# EAGLE schematic 428-300-001 S120041 D&R.rpt (EAGLE 6.5)

## Sheet 1 of 4
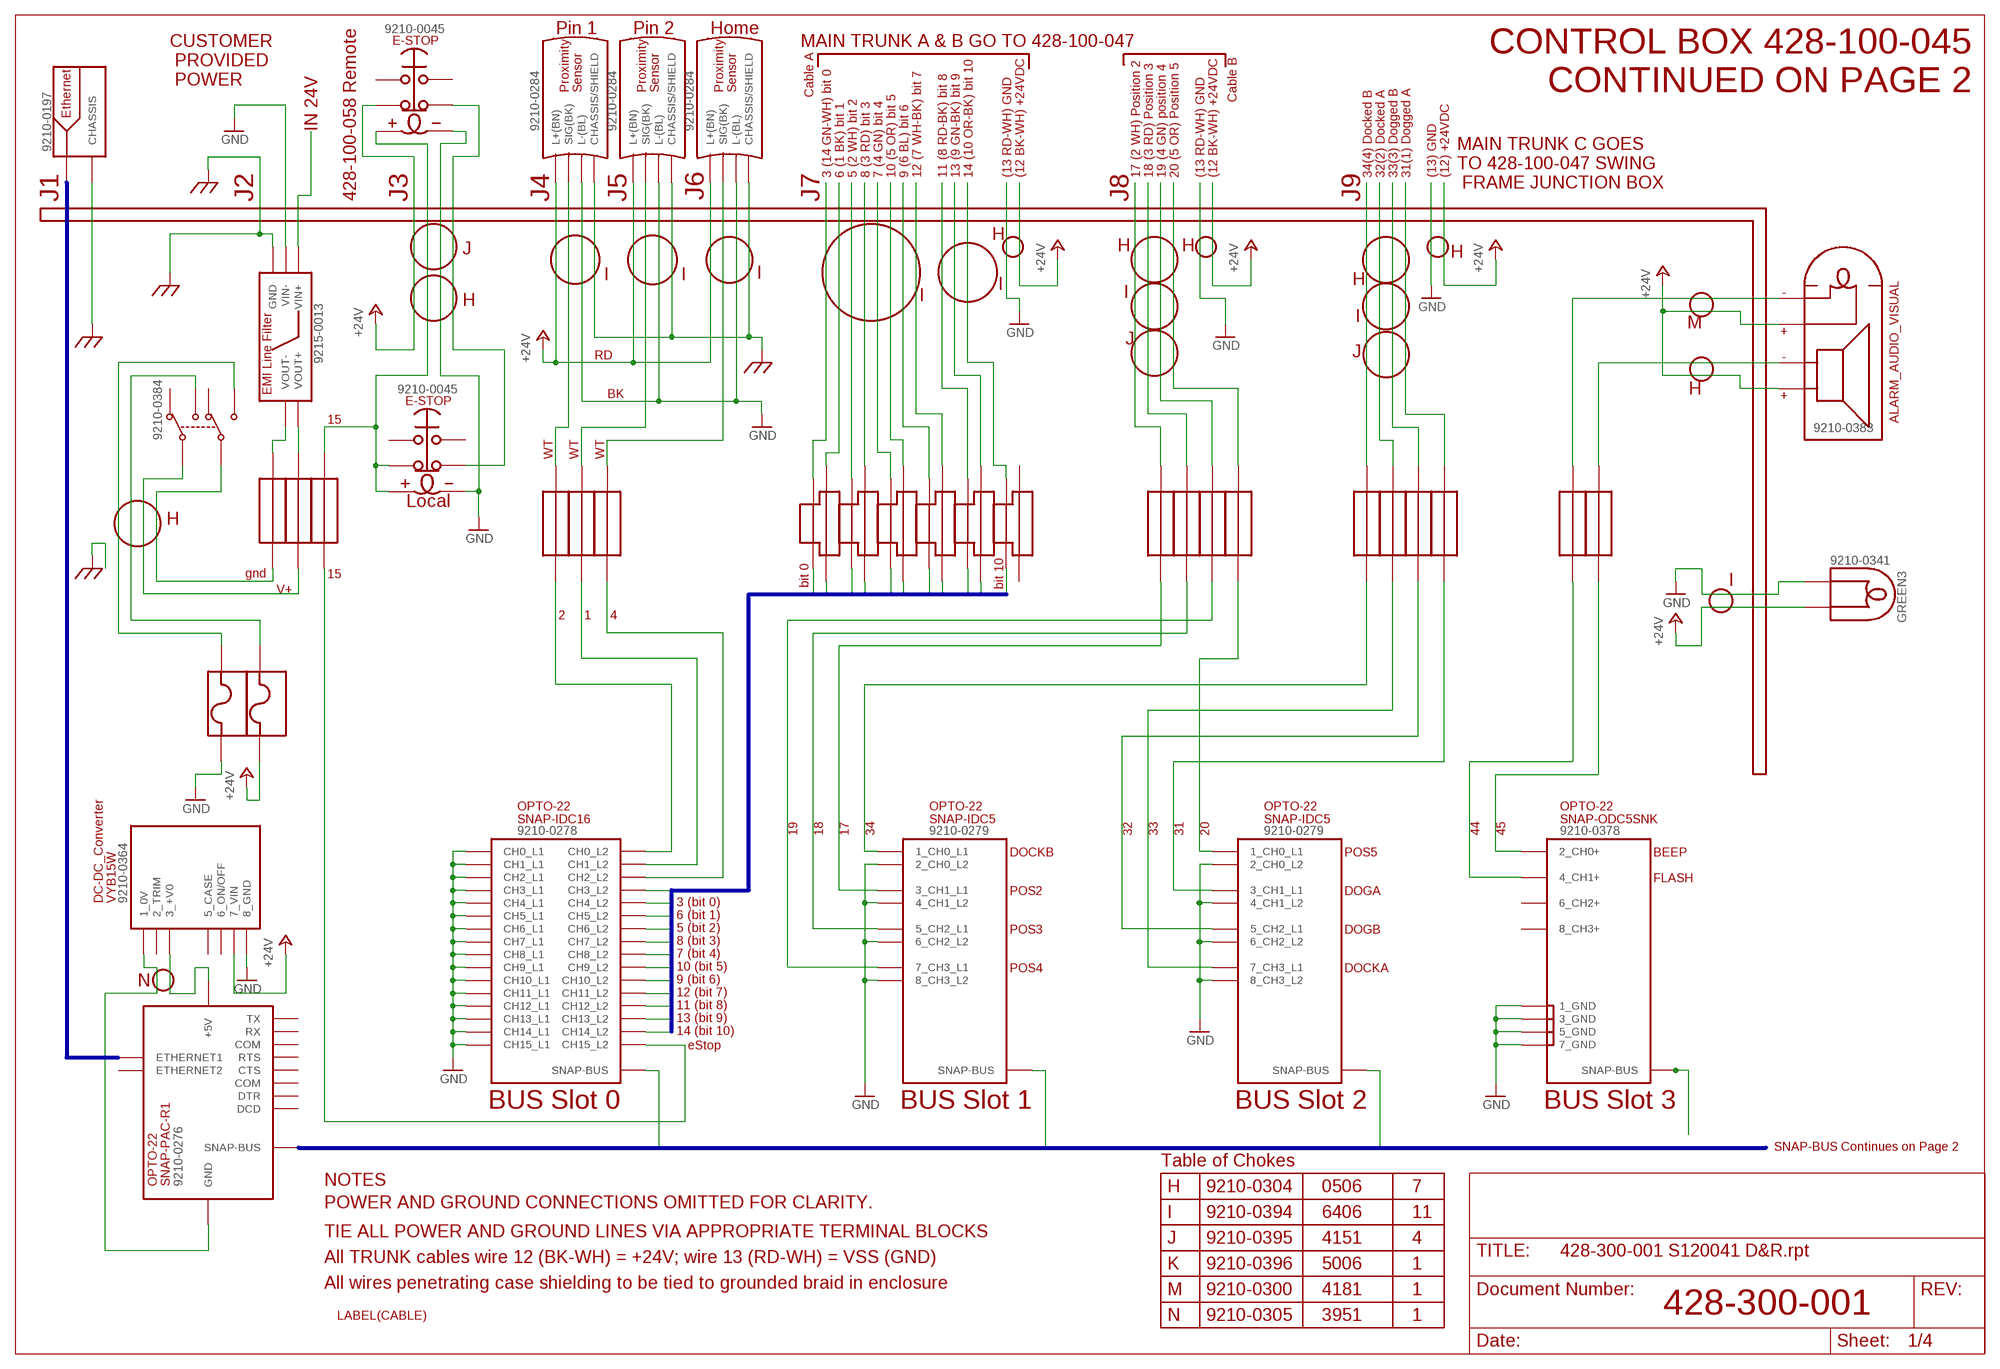
[diagram p0: schematic, sheet 1]

### Parts
GREEN3  9210-0341  INDICATOR_LIGHT  [BOGUS]
PE1  GND_CHASSIS  [BOGUS]
PE2  GND_CHASSIS  [BOGUS]
PE3  GND_CHASSIS  [BOGUS]
PE4  GND_CHASSIS  [BOGUS]
PE5  GND_CHASSIS  [BOGUS]
U$1  9210-0276  SNAP-PAC-R1  [BOGUS]
U$2  9210-0197  ETHERNET_PANEL_CONNECTOR9210-0197  [BOGUS]
U$3  9210-0278  SNAP-IDC16  [BOGUS]
U$4  9210-0279  SNAP-IDC5  [BOGUS]
U$5  9210-0279  SNAP-IDC5  [BOGUS]
U$6  9210-0364  DC-DC_CONVERTER_VYB15W  [BOGUS]
U$7  9210-0284  SENSOR_PROXIMITY  [BOGUS]
U$8  9210-0284  SENSOR_PROXIMITY  [BOGUS]
U$9  9210-0284  SENSOR_PROXIMITY  [BOGUS]
U$10  TERMINAL_BLOCK_3031160  [BOGUS]
U$11  TERMINAL_BLOCK_FUSED  [BOGUS]
U$12  TERMINAL_BLOCK_FUSED  [BOGUS]
U$13  9210-0045  SWITCH_ESTOP_LIGHTED  [BOGUS]
U$15  9210-0384  SWITCH_DPDT  [BOGUS]
U$16  9215-0013  FILTER_LINE_EMI  [BOGUS]
U$26  TERMINAL_BLOCK_3031160  [BOGUS]
U$27  TERMINAL_BLOCK_3031160  [BOGUS]
U$28  TERMINAL_BLOCK_3031160  [BOGUS]
U$29  TERMINAL_BLOCK_3031160  [BOGUS]
U$30  TERMINAL_BLOCK_3031160  [BOGUS]
U$31  9210-0045  SWITCH_ESTOP_LIGHTED  [BOGUS]
U$32  TERMINAL_BLOCK_1608510000  [BOGUS]
U$33  TERMINAL_BLOCK_1608510000  [BOGUS]
U$34  TERMINAL_BLOCK_1608510000  [BOGUS]
U$35  TERMINAL_BLOCK_1608510000  [BOGUS]
U$36  TERMINAL_BLOCK_1608510000  [BOGUS]
U$37  TERMINAL_BLOCK_1608510000  [BOGUS]
U$38  TERMINAL_BLOCK_1608510000  [BOGUS]
U$39  TERMINAL_BLOCK_1608510000  [BOGUS]
U$40  9210-0383  ALARM_AUDIO_VISUAL  [BOGUS]
U$41  TERMINAL_BLOCK_1608510000  [BOGUS]
U$42  TERMINAL_BLOCK_1608510000  [BOGUS]
U$43  TERMINAL_BLOCK_1608510000  [BOGUS]
U$44  TERMINAL_BLOCK_1608510000  [BOGUS]
U$45  TERMINAL_BLOCK_1608510000  [BOGUS]
U$46  TERMINAL_BLOCK_1608510000  [BOGUS]
U$47  TERMINAL_BLOCK_1608510000  [BOGUS]
U$48  TERMINAL_BLOCK_1608510000  [BOGUS]
U$49  9210-0378  SNAP-ODC5SNK  [BOGUS]

### Nets
+24V: GREEN3.P$2 U$6.P$7(7_VIN) U$7.P$2(L+(BN)) U$8.P$2(L+(BN)) U$9.P$2(L+(BN)) U$12.P$1 U$13.P$2 U$40.P$2 U$40.P$3 ; also sheet 2,3
B$1: U$3.P$33(SNAP-BUS) U$4.P$9(SNAP-BUS) U$5.P$9(SNAP-BUS) U$49.P$9(SNAP-BUS)
BIT1: U$3.P$30(CH14_L2)
BIT2: U$3.P$28(CH13_L2) U$30.P$1
BIT3: U$3.P$26(CH12_L2) U$29.P$2
BIT4: U$3.P$24(CH11_L2) U$29.P$1
BIT5: U$3.P$22(CH10_L2) U$28.P$2
BIT6: U$3.P$20(CH9_L2) U$28.P$1
BIT7: U$3.P$18(CH8_L2) U$27.P$2
BIT8: U$3.P$16(CH7_L2) U$27.P$1
BIT9: U$3.P$14(CH6_L2) U$26.P$2
BIT10: U$3.P$12(CH5_L2) U$26.P$1
BIT11: U$3.P$10(CH4_L2) U$10.P$2
BIT36: U$3.P$8(CH3_L2) U$10.P$1
GND: GREEN3.P$1 U$3.P$1(CH0_L1) U$3.P$3(CH1_L1) U$3.P$5(CH2_L1) U$3.P$7(CH3_L1) U$3.P$9(CH4_L1) U$3.P$11(CH5_L1) U$3.P$13(CH6_L1) U$3.P$15(CH7_L1) U$3.P$17(CH8_L1) U$3.P$19(CH9_L1) U$3.P$21(CH10_L1) U$3.P$23(CH11_L1) U$3.P$25(CH12_L1) U$3.P$27(CH13_L1) U$3.P$29(CH14_L1) U$3.P$31(CH15_L1) U$4.P$2(2_CH0_L2) U$4.P$4(4_CH1_L2) U$4.P$6(6_CH2_L2) U$4.P$8(8_CH3_L2) U$5.P$2(2_CH0_L2) U$5.P$4(4_CH1_L2) U$5.P$6(6_CH2_L2) U$5.P$8(8_CH3_L2) U$6.P$8(8_GND) U$7.P$3(L-(BL)) U$8.P$3(L-(BL)) U$9.P$3(L-(BL)) U$11.P$1 U$13.P$6 U$16.P$3(VIN-) U$31.P$6 U$49.P$5(1_GND) U$49.P$6(3_GND) U$49.P$7(5_GND) U$49.P$8(7_GND) ; also sheet 2,3
N$1: U$1.P$9(GND) U$6.P$2(1_0V)
N$2: U$1.P$1(+5V) U$6.P$4(3_+V0)
N$6: U$30.P$4
N$7: U$29.P$3
N$8: U$29.P$4
N$9: U$28.P$3
N$10: U$28.P$4
N$11: U$27.P$3
N$12: U$27.P$4
N$13: U$26.P$3
N$14: U$16.P$2(VIN+)
N$15: U$26.P$4
N$16: U$10.P$3
N$21: U$16.P$5(VOUT-) U$48.P$2
N$22: U$16.P$4(VOUT+) U$47.P$2
N$28: U$10.P$4
N$29: U$7.P$4(SIG(BK)) U$45.P$2
N$30: U$8.P$4(SIG(BK)) U$44.P$2
N$31: U$9.P$4(SIG(BK)) U$43.P$2
N$32: U$5.P$1(1_CH0_L1) U$39.P$1
N$33: U$5.P$3(3_CH1_L1) U$38.P$1
N$34: U$5.P$5(5_CH2_L1) U$37.P$1
N$35: U$5.P$7(7_CH3_L1) U$36.P$1
N$36: U$4.P$1(1_CH0_L1) U$35.P$1
N$37: U$4.P$3(3_CH1_L1) U$34.P$1
N$38: U$4.P$5(5_CH2_L1) U$33.P$1
N$39: U$4.P$7(7_CH3_L1) U$32.P$1
N$40: U$32.P$2
N$41: U$34.P$2
N$42: U$35.P$2
N$43: U$36.P$2
N$44: U$37.P$2
N$45: U$38.P$2
N$46: U$39.P$2
N$47: U$13.P$4 U$31.P$4
N$48: U$3.P$32(CH15_L2) U$46.P$1
N$49: U$33.P$2
N$50: U$41.P$1 U$49.P$2(4_CH1+)
N$51: U$42.P$1 U$49.P$1(2_CH0+)
N$52: U$40.P$1 U$42.P$2
N$53: U$40.P$4 U$41.P$2
N$54: U$3.P$6(CH2_L2) U$43.P$1
N$55: U$3.P$4(CH1_L2) U$44.P$1
N$56: U$3.P$2(CH0_L2) U$45.P$1
N$58: U$15.P$4 U$48.P$1
N$59: U$15.P$1 U$47.P$1
N$60: U$12.P$2 U$15.P$3
N$61: U$11.P$2 U$15.P$6
N$62: U$13.P$5 U$31.P$2 U$31.P$5 U$46.P$2
PE: PE1.P$1(PE) PE2.P$1(PE) PE3.P$1(PE) PE4.P$1(PE) PE5.P$1(PE) U$2.P$2(CHASSIS) U$7.P$1(CHASSIS/SHIELD) U$8.P$1(CHASSIS/SHIELD) U$9.P$1(CHASSIS/SHIELD) U$16.P$1(GND) ; also sheet 3
Unconnected: U$1.P$2(COM) U$1.P$3(COM) U$1.P$4(CTS) U$1.P$5(DCD) U$1.P$6(DTR) U$1.P$7(ETHERNET1) U$1.P$8(ETHERNET2) U$1.P$10(RTS) U$1.P$11(RX) U$1.P$12(SNAP-BUS) U$1.P$13(TX) U$2.P$1 U$6.P$3(2_TRIM) U$6.P$5(5_CASE) U$6.P$6(6_ON/OFF) U$13.P$1 U$13.P$3 U$15.P$2 U$15.P$5 U$30.P$2 U$30.P$3 U$31.P$1 U$31.P$3 U$49.P$3(6_CH2+) U$49.P$4(8_CH3+)

### Buses
B$1
BIT[0..11]
B$2

### Notes on the sheet
- 428-100-058 Remote | CONTROL BOX 428-100-045
- Pin 1 | Pin 2 | Home
- CUSTOMER | MAIN TRUNK A & B GO TO 428-100-047
- PROVIDED | CONTINUED ON PAGE 2
- POWER
- Cable A
- Cable B
- IN 24V
- MAIN TRUNK C GOES
- TO 428-100-047 SWING
- 3 (14 GN-WH) bit 0 | 6 (1 BK) bit 1 | 5 (2 WH) bit 2 | 8 (3 RD) bit 3 | 7 (4 GN) bit 4 | 10 (5 OR) bit 5 | 9 (6 BL) bit 6 | 12 (7 WH-BK) bit 7 | 11 (8 RD-BK) bit 8 | 13 (9 GN-BK) bit 9 | 14 (10 OR-BK) bit 10 | (13 RD-WH) GND | (12 BK-WH) +24VDC | 17 (2 WH) Position 2 | 18 (3 RD) Position 3 | 19 (4 GN) position 4 | 20 (5 OR) Position 5 | (13 RD-WH) GND | (12 BK-WH) +24VDC | 34(4) Docked B | 32(2) Docked A | 33(3) Dogged B | 31(1) Dogged A | (13) GND | (12) +24VDC
- FRAME JUNCTION BOX
- J1 | J2 | J3 | J4 | J5 | J6 | J7 | J8 | J9
- H
- J | H | H
- H
- I | I | I
- I | H
- I | -
- H | I
- I
- M
- +
- J
- RD | J | -
- BK | H
- +
- 15
- WT | WT | WT
- Local
- H
- gnd
- 15
- V+ | bit 0 | I
- bit 10
- 2 | 1 | 4
- 19 | 18 | 17 | 34 | 32 | 33 | 31 | 20 | 44 | 45
- DOCKB | POS5 | BEEP
- FLASH
- POS2 | DOGA
- 3 (bit 0)
- 6 (bit 1)
- 5 (bit 2) | POS3 | DOGB
- 8 (bit 3)
- 7 (bit 4)
- 10 (bit 5) | POS4 | DOCKA
- N | 9 (bit 6)
- 12 (bit 7)
- 11 (bit 8)
- 13 (bit 9)
- 14 (bit 10)
- eStop
- BUS Slot 0 | BUS Slot 1 | BUS Slot 2 | BUS Slot 3
- SNAP-BUS Continues on Page 2
- Table of Chokes
- NOTES
- H | 9210-0304 | 0506 | 7
- POWER AND GROUND CONNECTIONS OMITTED FOR CLARITY.
- I | 9210-0394 | 6406 | 11
- TIE ALL POWER AND GROUND LINES VIA APPROPRIATE TERMINAL BLOCKS
- J | 9210-0395 | 4151 | 4
- All TRUNK cables wire 12 (BK-WH) = +24V; wire 13 (RD-WH) = VSS (GND)
- K | 9210-0396 | 5006 | 1
- All wires penetrating case shielding to be tied to grounded braid in enclosure
- M | 9210-0300 | 4181 | 1
- 428-300-001
- LABEL(CABLE) | N | 9210-0305 | 3951 | 1

## Sheet 2 of 4
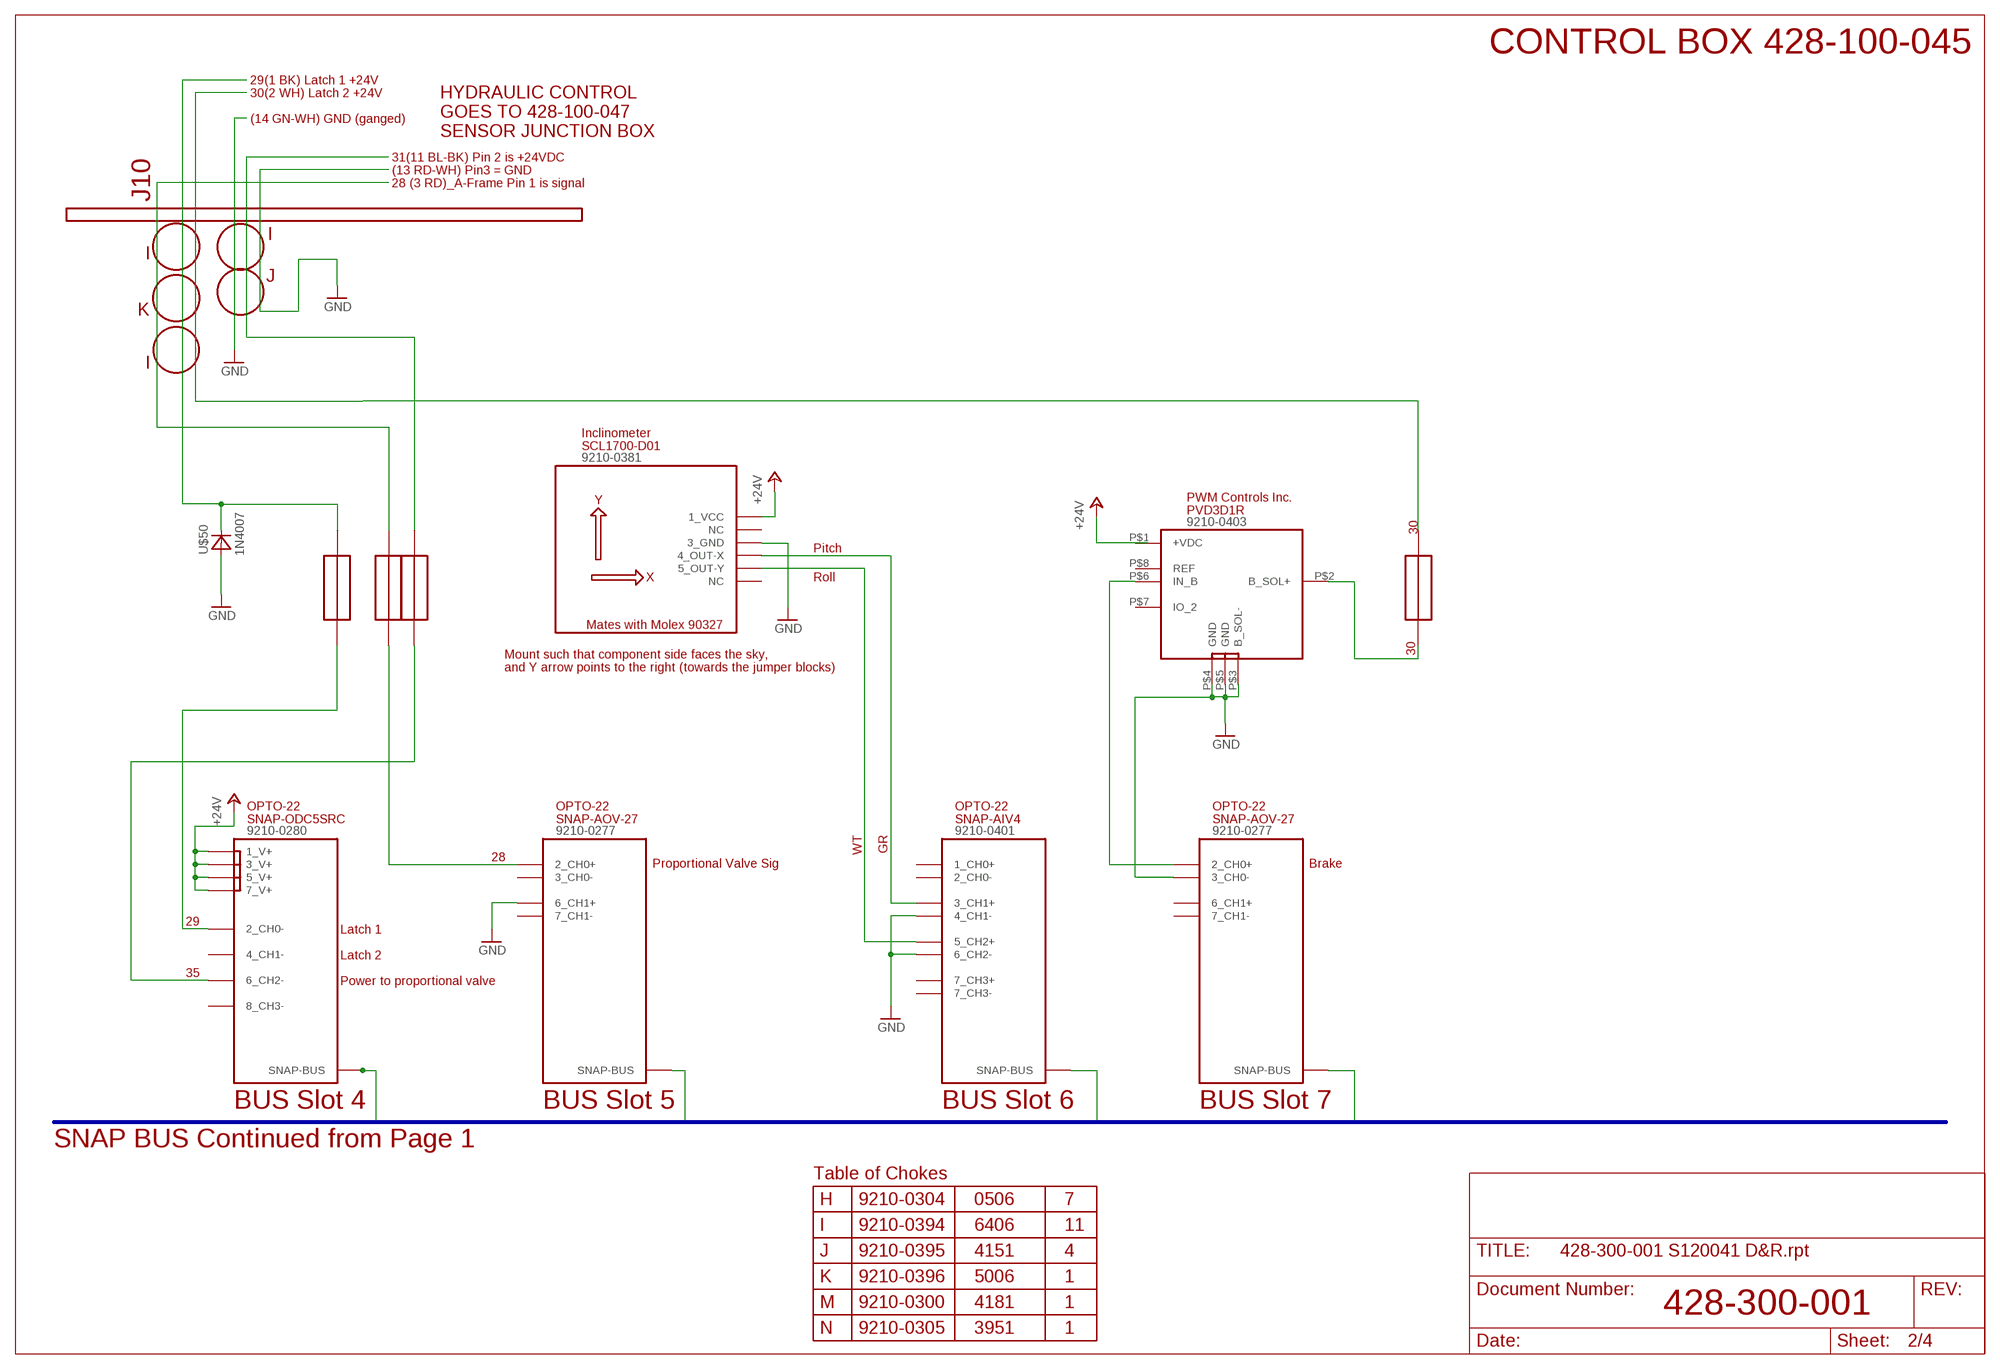
[diagram p1: schematic, sheet 2]

### Parts
U$14  9210-0277  SNAP-AOV-27  [BOGUS]
U$17  9210-0403  DRIVER_PWM_PVD3D1R  [BOGUS]
U$18  TERMINAL_BLOCK_1608510000  [BOGUS]
U$50  1N4007  [DO41]
U$51  9210-0381  INCLINOMETER_SCL1700-D01  [BOGUS]
U$78  TERMINAL_BLOCK_1608510000  [BOGUS]
U$80  TERMINAL_BLOCK_1608510000  [BOGUS]
U$122  TERMINAL_BLOCK_1608510000  [BOGUS]
U$126  9210-0280  SNAP-ODC5SRC  [BOGUS]
U$127  9210-0401  SNAP-AIV-4  [BOGUS]
U$131  9210-0277  SNAP-AOV-27  [BOGUS]

### Nets
+24V: U$51.P$1(1_VCC) U$126.P$1(1_V+) U$126.P$3(3_V+) U$126.P$5(5_V+) U$126.P$7(7_V+) ; also sheet 1,3
B$2: U$14.P$5(SNAP-BUS) U$126.P$9(SNAP-BUS) U$127.P$9(SNAP-BUS) U$131.P$5(SNAP-BUS)
GND: U$14.P$2(3_CH0-) U$17.P$3(B_SOL-) U$17.P$4(GND) U$17.P$5(GND) U$50.A U$51.P$2(3_GND) U$127.P$4(4_CH1-) U$127.P$6(6_CH2-) U$131.P$3(6_CH1+) ; also sheet 1,3
N$4: U$17.P$2(B_SOL+) U$18.P$1
N$5: U$14.P$1(2_CH0+) U$17.P$6(IN_B)
N$19: U$51.P$3(4_OUT-X) U$127.P$3(3_CH1+)
N$20: U$51.P$4(5_OUT-Y) U$127.P$5(5_CH2+)
N$23: U$18.P$2
N$93: U$80.P$1 U$131.P$1(2_CH0+)
N$94: U$50.C U$78.P$2
N$103: U$80.P$2
N$112: U$78.P$1 U$126.P$2(2_CH0-)
N$162: U$122.P$1 U$126.P$6(6_CH2-)
N$168: U$122.P$2
Unconnected: U$14.P$3(6_CH1+) U$14.P$4(7_CH1-) U$17.P$1(+VDC) U$17.P$7(IO_2) U$17.P$8(REF) U$51.P$5(NC) U$51.P$6(NC) U$126.P$4(4_CH1-) U$126.P$8(8_CH3-) U$127.P$1(1_CH0+) U$127.P$2(2_CH0-) U$127.P$7(7_CH3+) U$127.P$8(7_CH3-) U$131.P$2(3_CH0-) U$131.P$4(7_CH1-)

### Buses
B$1

### Notes on the sheet
- CONTROL BOX 428-100-045
- 29(1 BK) Latch 1 +24V
- 30(2 WH) Latch 2 +24V | HYDRAULIC CONTROL
- GOES TO 428-100-047
- (14 GN-WH) GND (ganged)
- SENSOR JUNCTION BOX
- 31(11 BL-BK) Pin 2 is +24VDC
- (13 RD-WH) Pin3 = GND
- 28 (3 RD)_A-Frame Pin 1 is signal
- J10
- I
- I
- J
- K
- I
- 30
- Pitch
- Roll
- Mount such that component side faces the sky, | 30
- and Y arrow points to the right (towards the jumper blocks)
- WT | GR
- 28
- Proportional Valve Sig | Brake
- 29
- Latch 1
- Latch 2
- 35
- Power to proportional valve
- BUS Slot 4 | BUS Slot 5 | BUS Slot 6 | BUS Slot 7
- SNAP BUS Continued from Page 1
- Table of Chokes
- H | 9210-0304 | 0506 | 7
- I | 9210-0394 | 6406 | 11
- J | 9210-0395 | 4151 | 4
- K | 9210-0396 | 5006 | 1
- M | 9210-0300 | 4181 | 1
- 428-300-001
- N | 9210-0305 | 3951 | 1

## Sheet 3 of 4
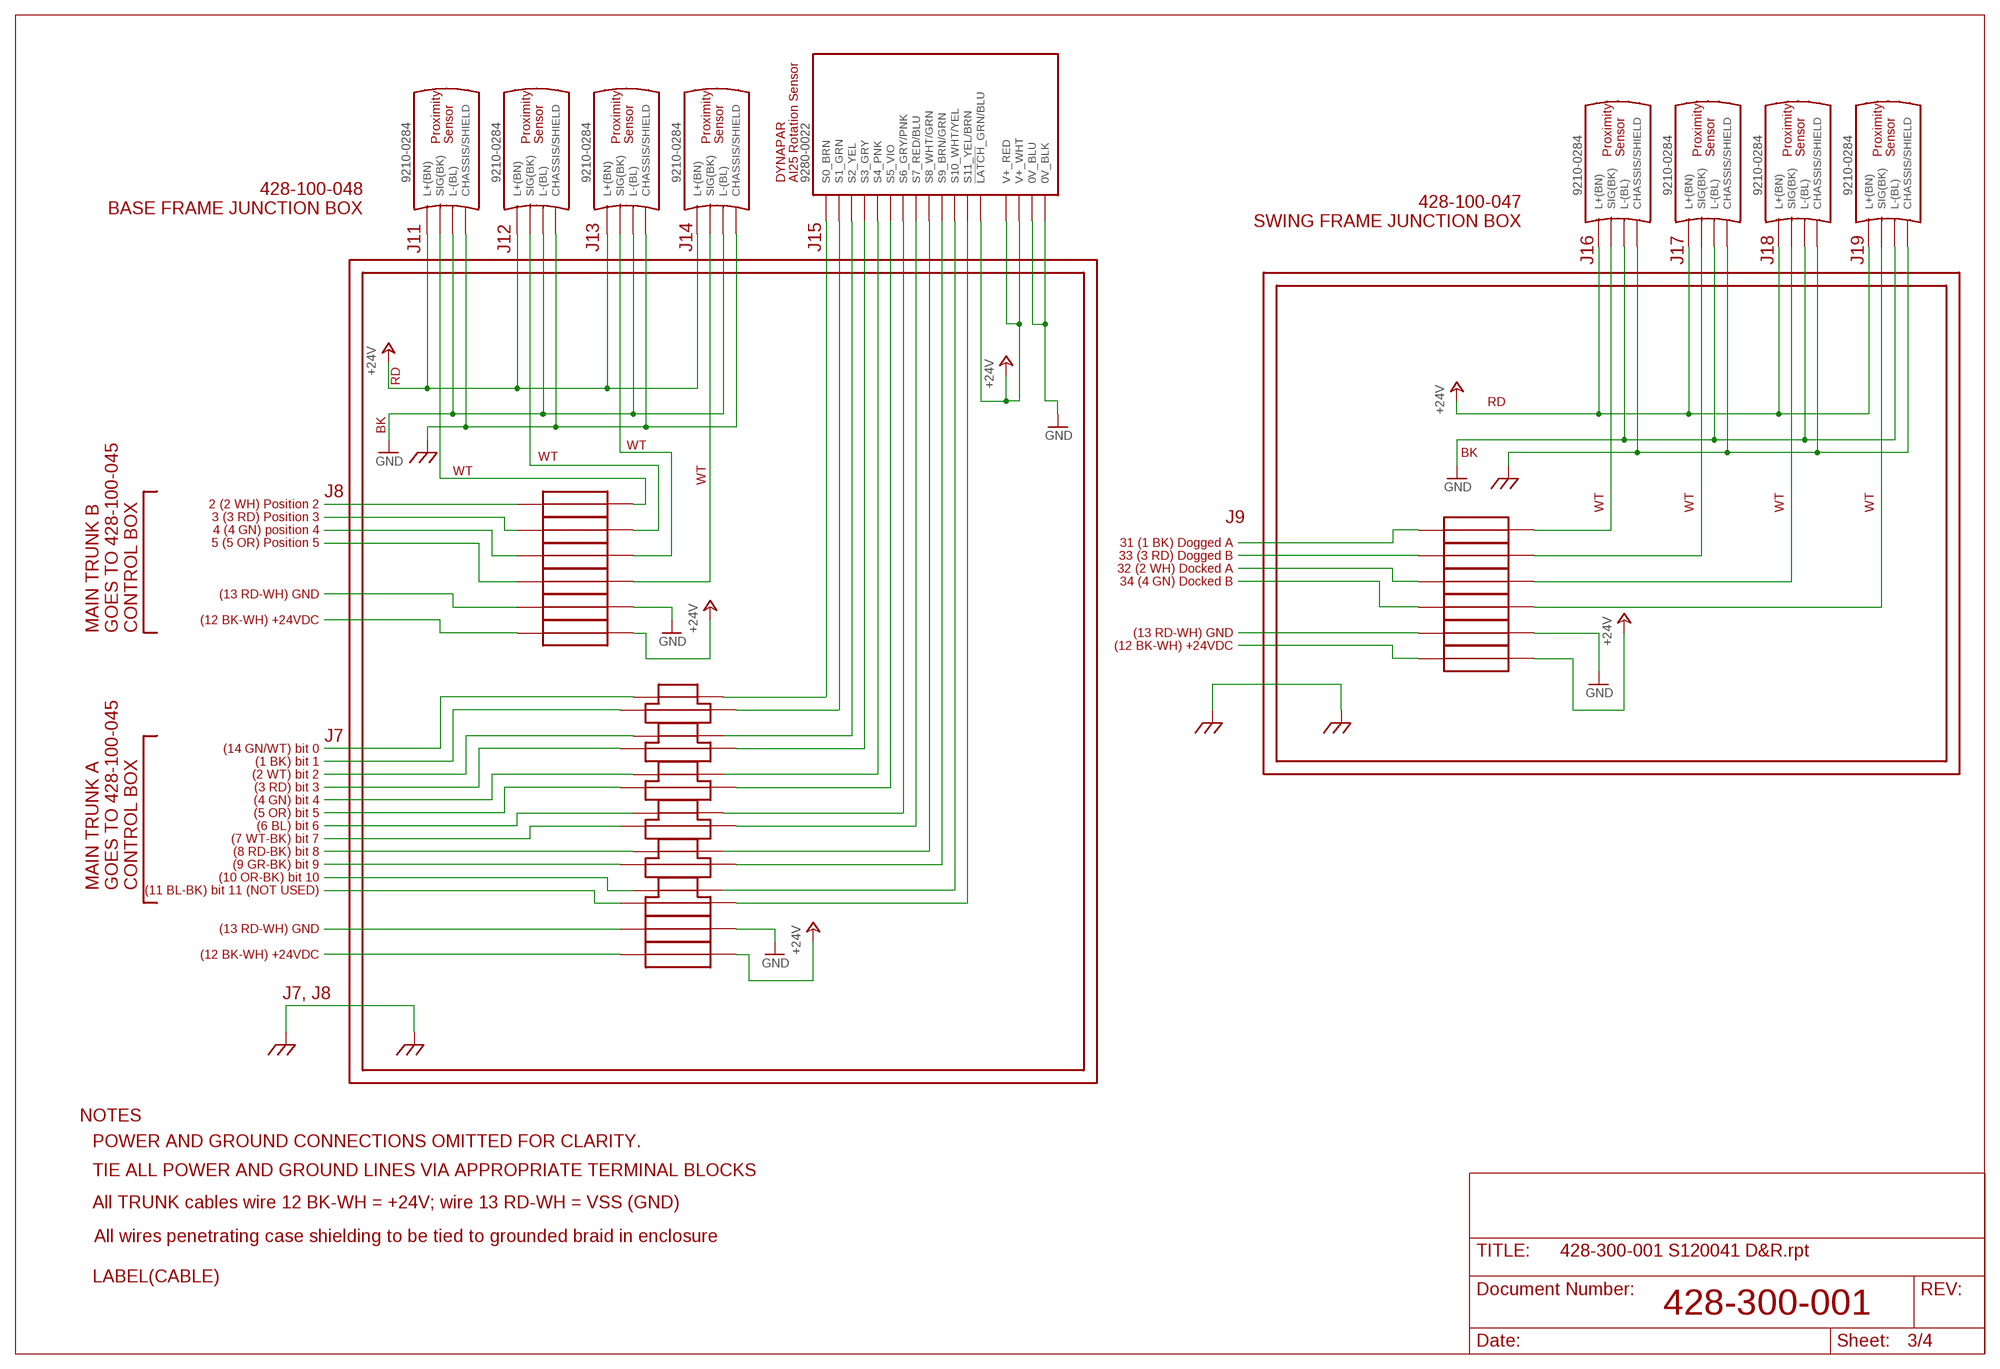
[diagram p2: schematic, sheet 3]

### Parts
PE9  GND_CHASSIS  [BOGUS]
PE10  GND_CHASSIS  [BOGUS]
PE11  GND_CHASSIS  [BOGUS]
PE12  GND_CHASSIS  [BOGUS]
PE19  GND_CHASSIS  [BOGUS]
PE20  GND_CHASSIS  [BOGUS]
U$63  TERMINAL_BLOCK_1608510000  [BOGUS]
U$64  TERMINAL_BLOCK_1608510000  [BOGUS]
U$81  TERMINAL_BLOCK_1608510000  [BOGUS]
U$87  TERMINAL_BLOCK_1608510000  [BOGUS]
U$88  TERMINAL_BLOCK_1608510000  [BOGUS]
U$89  TERMINAL_BLOCK_3031160  [BOGUS]
U$90  TERMINAL_BLOCK_3031160  [BOGUS]
U$91  TERMINAL_BLOCK_3031160  [BOGUS]
U$92  TERMINAL_BLOCK_3031160  [BOGUS]
U$93  TERMINAL_BLOCK_3031160  [BOGUS]
U$94  TERMINAL_BLOCK_3031160  [BOGUS]
U$95  TERMINAL_BLOCK_1608510000  [BOGUS]
U$96  9210-0284  SENSOR_PROXIMITY  [BOGUS]
U$97  9210-0284  SENSOR_PROXIMITY  [BOGUS]
U$98  9210-0284  SENSOR_PROXIMITY  [BOGUS]
U$99  9210-0284  SENSOR_PROXIMITY  [BOGUS]
U$100  TERMINAL_BLOCK_1608510000  [BOGUS]
U$101  TERMINAL_BLOCK_1608510000  [BOGUS]
U$102  TERMINAL_BLOCK_1608510000  [BOGUS]
U$103  TERMINAL_BLOCK_1608510000  [BOGUS]
U$104  TERMINAL_BLOCK_1608510000  [BOGUS]
U$105  TERMINAL_BLOCK_1608510000  [BOGUS]
U$106  9210-0284  SENSOR_PROXIMITY  [BOGUS]
U$107  9210-0284  SENSOR_PROXIMITY  [BOGUS]
U$108  9210-0284  SENSOR_PROXIMITY  [BOGUS]
U$109  9210-0284  SENSOR_PROXIMITY  [BOGUS]
U$110  9280-0022  ENCODER_AI25  [BOGUS]
U$111  TERMINAL_BLOCK_1608510000  [BOGUS]
U$112  TERMINAL_BLOCK_1608510000  [BOGUS]

### Nets
+24V: U$88.P$1 U$88.P$2 U$96.P$2(L+(BN)) U$97.P$2(L+(BN)) U$98.P$2(L+(BN)) U$99.P$2(L+(BN)) U$104.P$1 U$106.P$2(L+(BN)) U$107.P$2(L+(BN)) U$108.P$2(L+(BN)) U$109.P$2(L+(BN)) U$110.P$15(V+_RED) U$110.P$16(V+_WHT) U$110.P$17(!LATCH!_GRN/BLU) U$112.P$1 U$112.P$2 ; also sheet 1,2
GND: U$87.P$1 U$87.P$2 U$96.P$3(L-(BL)) U$97.P$3(L-(BL)) U$98.P$3(L-(BL)) U$99.P$3(L-(BL)) U$103.P$1 U$106.P$3(L-(BL)) U$107.P$3(L-(BL)) U$108.P$3(L-(BL)) U$109.P$3(L-(BL)) U$110.P$1(0V_BLK) U$110.P$2(0V_BLU) U$111.P$1 U$111.P$2 ; also sheet 1,2
N$104: U$90.P$1
N$105: U$90.P$2
N$106: U$89.P$1
N$107: U$89.P$2
N$108: U$91.P$1
N$109: U$91.P$2
N$110: U$92.P$1
N$111: U$92.P$2
N$116: U$93.P$1
N$121: U$93.P$2
N$122: U$94.P$1
N$123: U$94.P$2
N$124: U$81.P$2
N$125: U$63.P$2
N$126: U$95.P$2
N$127: U$64.P$2
N$128: U$94.P$3 U$110.P$14(S11_YEL/BRN)
N$129: U$94.P$4 U$110.P$13(S10_WHT/YEL)
N$130: U$93.P$3 U$110.P$12(S9_BRN/GRN)
N$131: U$93.P$4 U$110.P$11(S8_WHT/GRN)
N$132: U$92.P$3 U$110.P$10(S7_RED/BLU)
N$133: U$92.P$4 U$110.P$9(S6_GRY/PNK)
N$134: U$91.P$3 U$110.P$8(S5_VIO)
N$135: U$89.P$3 U$110.P$6(S3_GRY)
N$136: U$89.P$4 U$110.P$5(S2_YEL)
N$137: U$90.P$3 U$110.P$4(S1_GRN)
N$138: U$90.P$4 U$110.P$3(S0_BRN)
N$139: U$95.P$1 U$96.P$4(SIG(BK))
N$140: U$63.P$1 U$97.P$4(SIG(BK))
N$141: U$64.P$1 U$98.P$4(SIG(BK))
N$142: U$81.P$1 U$99.P$4(SIG(BK))
N$143: U$105.P$1 U$106.P$4(SIG(BK))
N$144: U$100.P$1 U$107.P$4(SIG(BK))
N$145: U$101.P$1 U$108.P$4(SIG(BK))
N$146: U$102.P$1 U$109.P$4(SIG(BK))
N$147: U$105.P$2
N$148: U$101.P$2
N$149: U$102.P$2
N$150: U$103.P$2
N$151: U$100.P$2
N$152: U$104.P$2
N$153: U$91.P$4 U$110.P$7(S4_PNK)
PE: PE9.P$1(PE) PE10.P$1(PE) PE11.P$1(PE) PE12.P$1(PE) PE19.P$1(PE) PE20.P$1(PE) U$96.P$1(CHASSIS/SHIELD) U$97.P$1(CHASSIS/SHIELD) U$98.P$1(CHASSIS/SHIELD) U$99.P$1(CHASSIS/SHIELD) U$106.P$1(CHASSIS/SHIELD) U$107.P$1(CHASSIS/SHIELD) U$108.P$1(CHASSIS/SHIELD) U$109.P$1(CHASSIS/SHIELD) ; also sheet 1

### Notes on the sheet
- 428-100-048
- 428-100-047
- BASE FRAME JUNCTION BOX
- SWING FRAME JUNCTION BOX
- J11 | J12 | J13 | J14 | J15
- J16 | J17 | J18 | J19
- RD
- RD
- BK
- WT | BK
- WT
- WT
- J8 | WT
- 2 (2 WH) Position 2
- 3 (3 RD) Position 3 | J9 | WT | WT | WT | WT
- 4 (4 GN) position 4
- 5 (5 OR) Position 5 | 31 (1 BK) Dogged A
- 33 (3 RD) Dogged B
- 32 (2 WH) Docked A
- 34 (4 GN) Docked B
- (13 RD-WH) GND
- (12 BK-WH) +24VDC
- (13 RD-WH) GND
- MAIN TRUNK B | GOES TO 428-100-045 | CONTROL BOX
- (12 BK-WH) +24VDC
- J7
- (14 GN/WT) bit 0
- (1 BK) bit 1
- (2 WT) bit 2
- (3 RD) bit 3
- (4 GN) bit 4
- (5 OR) bit 5
- (6 BL) bit 6
- (7 WT-BK) bit 7
- (8 RD-BK) bit 8
- (9 GR-BK) bit 9
- (10 OR-BK) bit 10
- (11 BL-BK) bit 11 (NOT USED)
- MAIN TRUNK A | GOES TO 428-100-045 | CONTROL BOX
- (13 RD-WH) GND
- (12 BK-WH) +24VDC
- J7, J8
- NOTES
- POWER AND GROUND CONNECTIONS OMITTED FOR CLARITY.
- TIE ALL POWER AND GROUND LINES VIA APPROPRIATE TERMINAL BLOCKS
- All TRUNK cables wire 12 BK-WH = +24V; wire 13 RD-WH = VSS (GND)
- All wires penetrating case shielding to be tied to grounded braid in enclosure
- LABEL(CABLE)
- 428-300-001

## Sheet 4 of 4
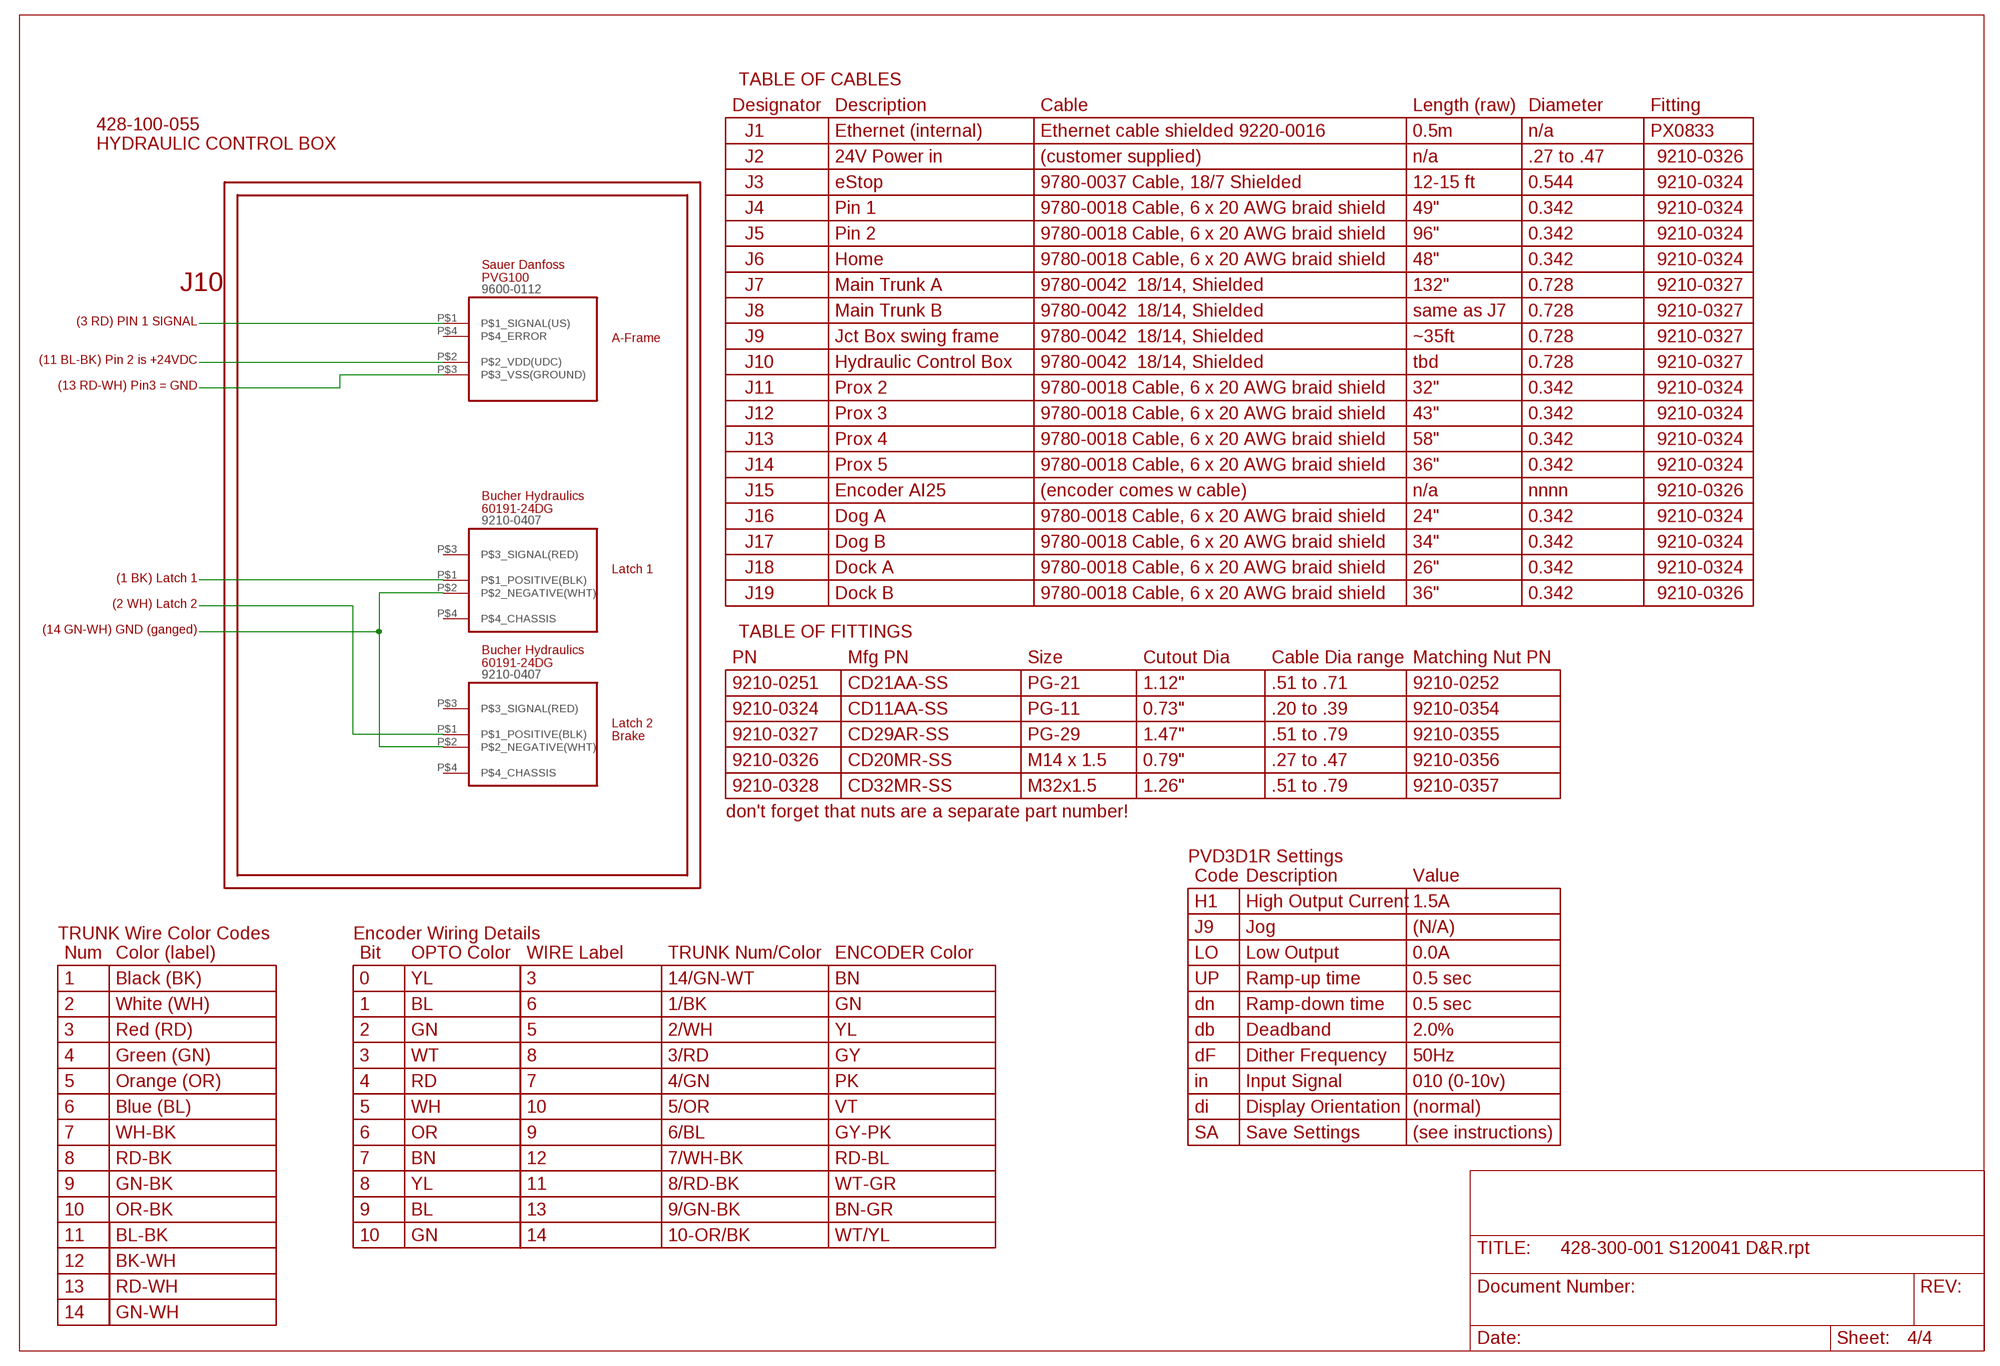
[diagram p3: schematic, sheet 4]

### Parts
U$82  9600-0112  VALVE_HYDRAULIC_PROPORTIONAL  [BOGUS]
U$85  9210-0407  VALVE_HYDRAULIC_SOLENOID  [BOGUS]
U$86  9210-0407  VALVE_HYDRAULIC_SOLENOID  [BOGUS]

### Nets
N$3: U$86.P$1(P$1_POSITIVE(BLK))
N$101: U$82.P$1(P$1_SIGNAL(US))
N$102: U$85.P$1(P$1_POSITIVE(BLK))
N$113: U$85.P$2(P$2_NEGATIVE(WHT)) U$86.P$2(P$2_NEGATIVE(WHT))
N$114: U$82.P$3(P$3_VSS(GROUND))
N$115: U$82.P$2(P$2_VDD(UDC))
Unconnected: U$82.P$4(P$4_ERROR) U$85.P$3(P$3_SIGNAL(RED)) U$85.P$4(P$4_CHASSIS) U$86.P$3(P$3_SIGNAL(RED)) U$86.P$4(P$4_CHASSIS)

### Notes on the sheet
- TABLE OF CABLES
- Designator | Description | Cable | Length (raw) | Diameter | Fitting
- 428-100-055
- J1 | Ethernet (internal) | Ethernet cable shielded 9220-0016 | 0.5m | n/a | PX0833
- HYDRAULIC CONTROL BOX
- J2 | 24V Power in | (customer supplied) | n/a | .27 to .47 | 9210-0326
- J3 | eStop | 9780-0037 Cable, 18/7 Shielded | 12-15 ft | 0.544 | 9210-0324
- J4 | Pin 1 | 9780-0018 Cable, 6 x 20 AWG braid shield | 49" | 0.342 | 9210-0324
- J5 | Pin 2 | 9780-0018 Cable, 6 x 20 AWG braid shield | 96" | 0.342 | 9210-0324
- J6 | Home | 9780-0018 Cable, 6 x 20 AWG braid shield | 48" | 0.342 | 9210-0324
- J10 | J7 | Main Trunk A | 9780-0042  18/14, Shielded | 132" | 0.728 | 9210-0327
- (3 RD) PIN 1 SIGNAL | J8 | Main Trunk B | 9780-0042  18/14, Shielded | same as J7 | 0.728 | 9210-0327
- A-Frame | J9 | Jct Box swing frame | 9780-0042  18/14, Shielded | ~35ft | 0.728 | 9210-0327
- (11 BL-BK) Pin 2 is +24VDC
- J10 | Hydraulic Control Box | 9780-0042  18/14, Shielded | tbd | 0.728 | 9210-0327
- (13 RD-WH) Pin3 = GND
- J11 | Prox 2 | 9780-0018 Cable, 6 x 20 AWG braid shield | 32" | 0.342 | 9210-0324
- J12 | Prox 3 | 9780-0018 Cable, 6 x 20 AWG braid shield | 43" | 0.342 | 9210-0324
- J13 | Prox 4 | 9780-0018 Cable, 6 x 20 AWG braid shield | 58" | 0.342 | 9210-0324
- J14 | Prox 5 | 9780-0018 Cable, 6 x 20 AWG braid shield | 36" | 0.342 | 9210-0324
- J15 | Encoder AI25 | (encoder comes w cable) | n/a | nnnn | 9210-0326
- J16 | Dog A | 9780-0018 Cable, 6 x 20 AWG braid shield | 24" | 0.342 | 9210-0324
- J17 | Dog B | 9780-0018 Cable, 6 x 20 AWG braid shield | 34" | 0.342 | 9210-0324
- (1 BK) Latch 1 | Latch 1 | J18 | Dock A | 9780-0018 Cable, 6 x 20 AWG braid shield | 26" | 0.342 | 9210-0324
- (2 WH) Latch 2 | J19 | Dock B | 9780-0018 Cable, 6 x 20 AWG braid shield | 36" | 0.342 | 9210-0326
- (14 GN-WH) GND (ganged)
- TABLE OF FITTINGS
- PN | Mfg PN | Size | Cutout Dia | Cable Dia range | Matching Nut PN
- 9210-0251 | CD21AA-SS | PG-21 | 1.12" | .51 to .71 | 9210-0252
- 9210-0324 | CD11AA-SS | PG-11 | 0.73" | .20 to .39 | 9210-0354
- Latch 2
- Brake | 9210-0327 | CD29AR-SS | PG-29 | 1.47" | .51 to .79 | 9210-0355
- 9210-0326 | CD20MR-SS | M14 x 1.5 | 0.79" | .27 to .47 | 9210-0356
- 9210-0328 | CD32MR-SS | M32x1.5 | 1.26" | .51 to .79 | 9210-0357
- don't forget that nuts are a separate part number!
- PVD3D1R Settings
- Code | Description | Value
- H1 | High Output Current | 1.5A
- J9 | Jog | (N/A)
- TRUNK Wire Color Codes | Encoder Wiring Details
- Num | Color (label) | Bit | OPTO Color | WIRE Label | TRUNK Num/Color | ENCODER Color | LO | Low Output | 0.0A
- 1 | Black (BK) | 0 | YL | 3 | 14/GN-WT | BN | UP | Ramp-up time | 0.5 sec
- 2 | White (WH) | 1 | BL | 6 | 1/BK | GN | dn | Ramp-down time | 0.5 sec
- 3 | Red (RD) | 2 | GN | 5 | 2/WH | YL | db | Deadband | 2.0%
- 4 | Green (GN) | 3 | WT | 8 | 3/RD | GY | dF | Dither Frequency | 50Hz
- 5 | Orange (OR) | 4 | RD | 7 | 4/GN | PK | in | Input Signal | 010 (0-10v)
- 6 | Blue (BL) | 5 | WH | 10 | 5/OR | VT | di | Display Orientation | (normal)
- 7 | WH-BK | 6 | OR | 9 | 6/BL | GY-PK | SA | Save Settings | (see instructions)
- 8 | RD-BK | 7 | BN | 12 | 7/WH-BK | RD-BL
- 9 | GN-BK | 8 | YL | 11 | 8/RD-BK | WT-GR
- 10 | OR-BK | 9 | BL | 13 | 9/GN-BK | BN-GR
- 11 | BL-BK | 10 | GN | 14 | 10-OR/BK | WT/YL
- 12 | BK-WH
- 13 | RD-WH
- 14 | GN-WH

## Library data of the parts
GREEN3 = DougM-SOSI-Wiring-Diagram:INDICATOR_LIGHT: 9210-0341 OMPBD7D-P3N3 Indicator Light, LED, Complete Asssembly, 22.5mm, IP66, 24V AC/DC Omega www.omega.com
PE1-PE5 PE9-PE12 PE19 PE20 = DougM-SOSI-Wiring-Diagram:GND_CHASSIS: SUPPLY SYMBOL
U$1 = DougM-SOSI-Wiring-Diagram:SNAP-PAC-R1: 9210-0276 SNAP-PAC-R1 Controller, Programmable Automation, R-Series, Analog, Full Digital, Serial Opto 22 Opto 22
U$2 = DougM-SOSI-Wiring-Diagram:ETHERNET_PANEL_CONNECTOR: 9210-0197 Connector, Panel Mount, Cat5e Coupler + Earth Wire, W/ Panel Sealing Gasket Digikey 708-1366-ND
U$3 = DougM-SOSI-Wiring-Diagram:SNAP-IDC16: 9210-0278 SNAP-IDC16 Module, Digital (Discrete) Input, Isolated 16-pt, 10-32 VDC Opto 22 Opto 22
U$4 U$5 = DougM-SOSI-Wiring-Diagram:SNAP-IDC5: 9210-0279 SNAP-IDC5 Module, Digital (Discrete) Input, 4-Channel 10-32 VAC/VDC Opto 22 Opto 22
U$6 = DougM-SOSI-Wiring-Diagram:DC-DC_CONVERTER_VYB15W: 9210-0364 VYB15W-Q24-S5-T Converter, DC/DC, 15W, 5V, 3A, CUI Inc. #VYB15W-Q24-S5-T CUI Inc Digikey 102-2334-ND
U$7-U$9 U$96-U$99 U$106-U$109 = DougM-SOSI-Wiring-Diagram:SENSOR_PROXIMITY: 9210-0023 Proximity Sensor, Inductive, 5mm Dia., 10-30 VDC, 3-wire, NPN, Shielded, 1.5mm nominal sensing distance, N.O., 2-meter cable 9210-0088 Proximity Sensor, Inductive, 12mm Dia., 10-30 VDC, 3-wire, unshielded, 8mm nominal sensing distance, N.O., 2-meter cable 9210-0191 Proximity Sensor, Inductive, 8mm Dia., extended range, 10-30 VDC, 3-wire, NPN, N.O., 4mm nominal sensing distance, unshielded 2-meter cable 9210-0284 Sensor, Proximity, Inductive, 18mm Dia., Extended Range, 10-30 VDC, 3 Wire, NPN, shielded, 2-Meter Cable Manufacturer Automation Direct
U$10 U$26-U$30 U$89-U$94 = DougM-SOSI-Wiring-Diagram:TERMINAL_BLOCK_3031160: 9210-0343 3031160 FEED THROUGH TERM BLOCK 14-26AWG Phoenix Contact Digikey 277-4014-ND
U$11 U$12 = DougM-SOSI-Wiring-Diagram:TERMINAL_BLOCK_FUSED: 9210-0372 7641K943 Modular DIN Rail-Mount Terminal Block DIN 1 & 3, w/ Blown Fuse Indicator, 8mm, 24 VDC McMasterr McMaster 7641K943
U$13 U$31 = DougM-SOSI-Wiring-Diagram:SWITCH_ESTOP_LIGHTED: 9210-0045 Switch, Emergency Stop, w/ #800T-XA4 contact block (old #800H-FRXTQH10RA4) Allen Bradley 800H-FRXTQH2RA4
U$14 U$131 = DougM-SOSI-Wiring-Diagram:SNAP-AOV-27: 9210-NNNN SNAP-AOV-27 Dual-channel analog output voltage 0 to 10 VDC Opto 22 Opto 22
U$15 = DougM-SOSI-Wiring-Diagram:SWITCH_DPDT: 9210-0123 Switch, Non-Illuminated, 30.5mm, Type 4/4x/13, 2 Pos. Selector, Std. Knob Maint, 1 N.O.-1 N.C., WHITE 9210-0175?? Switch, Selector, 2-Position, Maintained, Blk handle w/ wht insert (old #800H-24HRAH2KB6AX)
U$16 = DougM-SOSI-Wiring-Diagram:FILTER_LINE_EMI: 9210-0233 VFM-15C DC EMI Filter Module, 75V., 15A, #VFM-15C Digikey 102-2056-ND 9215-0013 428-300-002 EMI Filter Board 428-300-002
U$17 = DougM-SOSI-Wiring-Diagram:DRIVER_PWM_PVD3D1R: 9210-0403 Proportional Valve Driver one PWM solenoid output, open board in DIN rail card holder PVD3D1R PWM Controls Inc.r
U$18 U$32-U$39 U$41-U$48 U$63 U$64 U$78 U$80 U$81 U$87 U$88 U$95 U$100-U$105 U$111 U$112 U$122 = DougM-SOSI-Wiring-Diagram:TERMINAL_BLOCK_1608510000: 9210-0348 1608510000 CONN TERM SGL 600V 25A WM BG Weidmuller Digikey 281-2928-ND
U$40 = DougM-SOSI-Wiring-Diagram:ALARM_AUDIO_VISUAL: 9210-0383 290LFMT4 LED Flashing Light and Horn, 12/24 VDC, AMBER SignalGuys www.SignalGuys.com
U$49 = DougM-SOSI-Wiring-Diagram:SNAP-ODC5SNK: 9210-0378 SNAP-ODC5SNK 4-channel DC output 5-60 VDC logic sink Opto 22 Opto 22
U$50 = hankl:1N4007
U$51 = DougM-SOSI-Wiring-Diagram:INCLINOMETER_SCL1700-D01: 9210-0381 SCL1700-D01 INCLINOMETER SUBASSEMBLY DL AXIS Murata Electronics North America Digikey 551-1020-ND
U$82 = DougM-SOSI-Wiring-Diagram:VALVE_HYDRAULIC_PROPORTIONAL: 9600-0112 Valve, Proportional, Single Bank, 45 GPM, 2000 PSI, Sauer-Danfoss PVG100 Sauer Danfoss PVG100 Berendsen Fluid Power
U$85 U$86 = DougM-SOSI-Wiring-Diagram:VALVE_HYDRAULIC_SOLENOID: NNNN-NNNN (Hydraulic Solenoid Valve) (MFG/Model unknown) (distributor unknown)
U$110 = DougM-SOSI-Wiring-Diagram:ENCODER_AI25: 9280-0022 A125-1212-2-B-0-2-A Encoder, ACURO Absolute, Series A125, Multi-turn 12-Bit, Sq. Flange, 3/8" shaft, Parallel Binary, 10-30 VDC Dynapar (supplier)
U$126 = DougM-SOSI-Wiring-Diagram:SNAP-ODC5SRC: 9210-0280 SNAP-ODC-5SRC Module, Digital (Discrete) Output, 4-Channel 5-60 VDC Opto 22 Opto 22
U$127 = DougM-SOSI-Wiring-Diagram:SNAP-AIV-4: 9210-0401 SNAP-AIV-4 4-channel analog voltage input -10 to +10 VDC or -5 to +5 VDC Opto 22 Opto 22